# Altium schematic sheet MCU+IO.SchDoc: MCU
size A3; DrawnBy: Mogens Groth Nicolaisen; DocumentNumber: 3; SheetNumber: 3; SheetTotal: 7
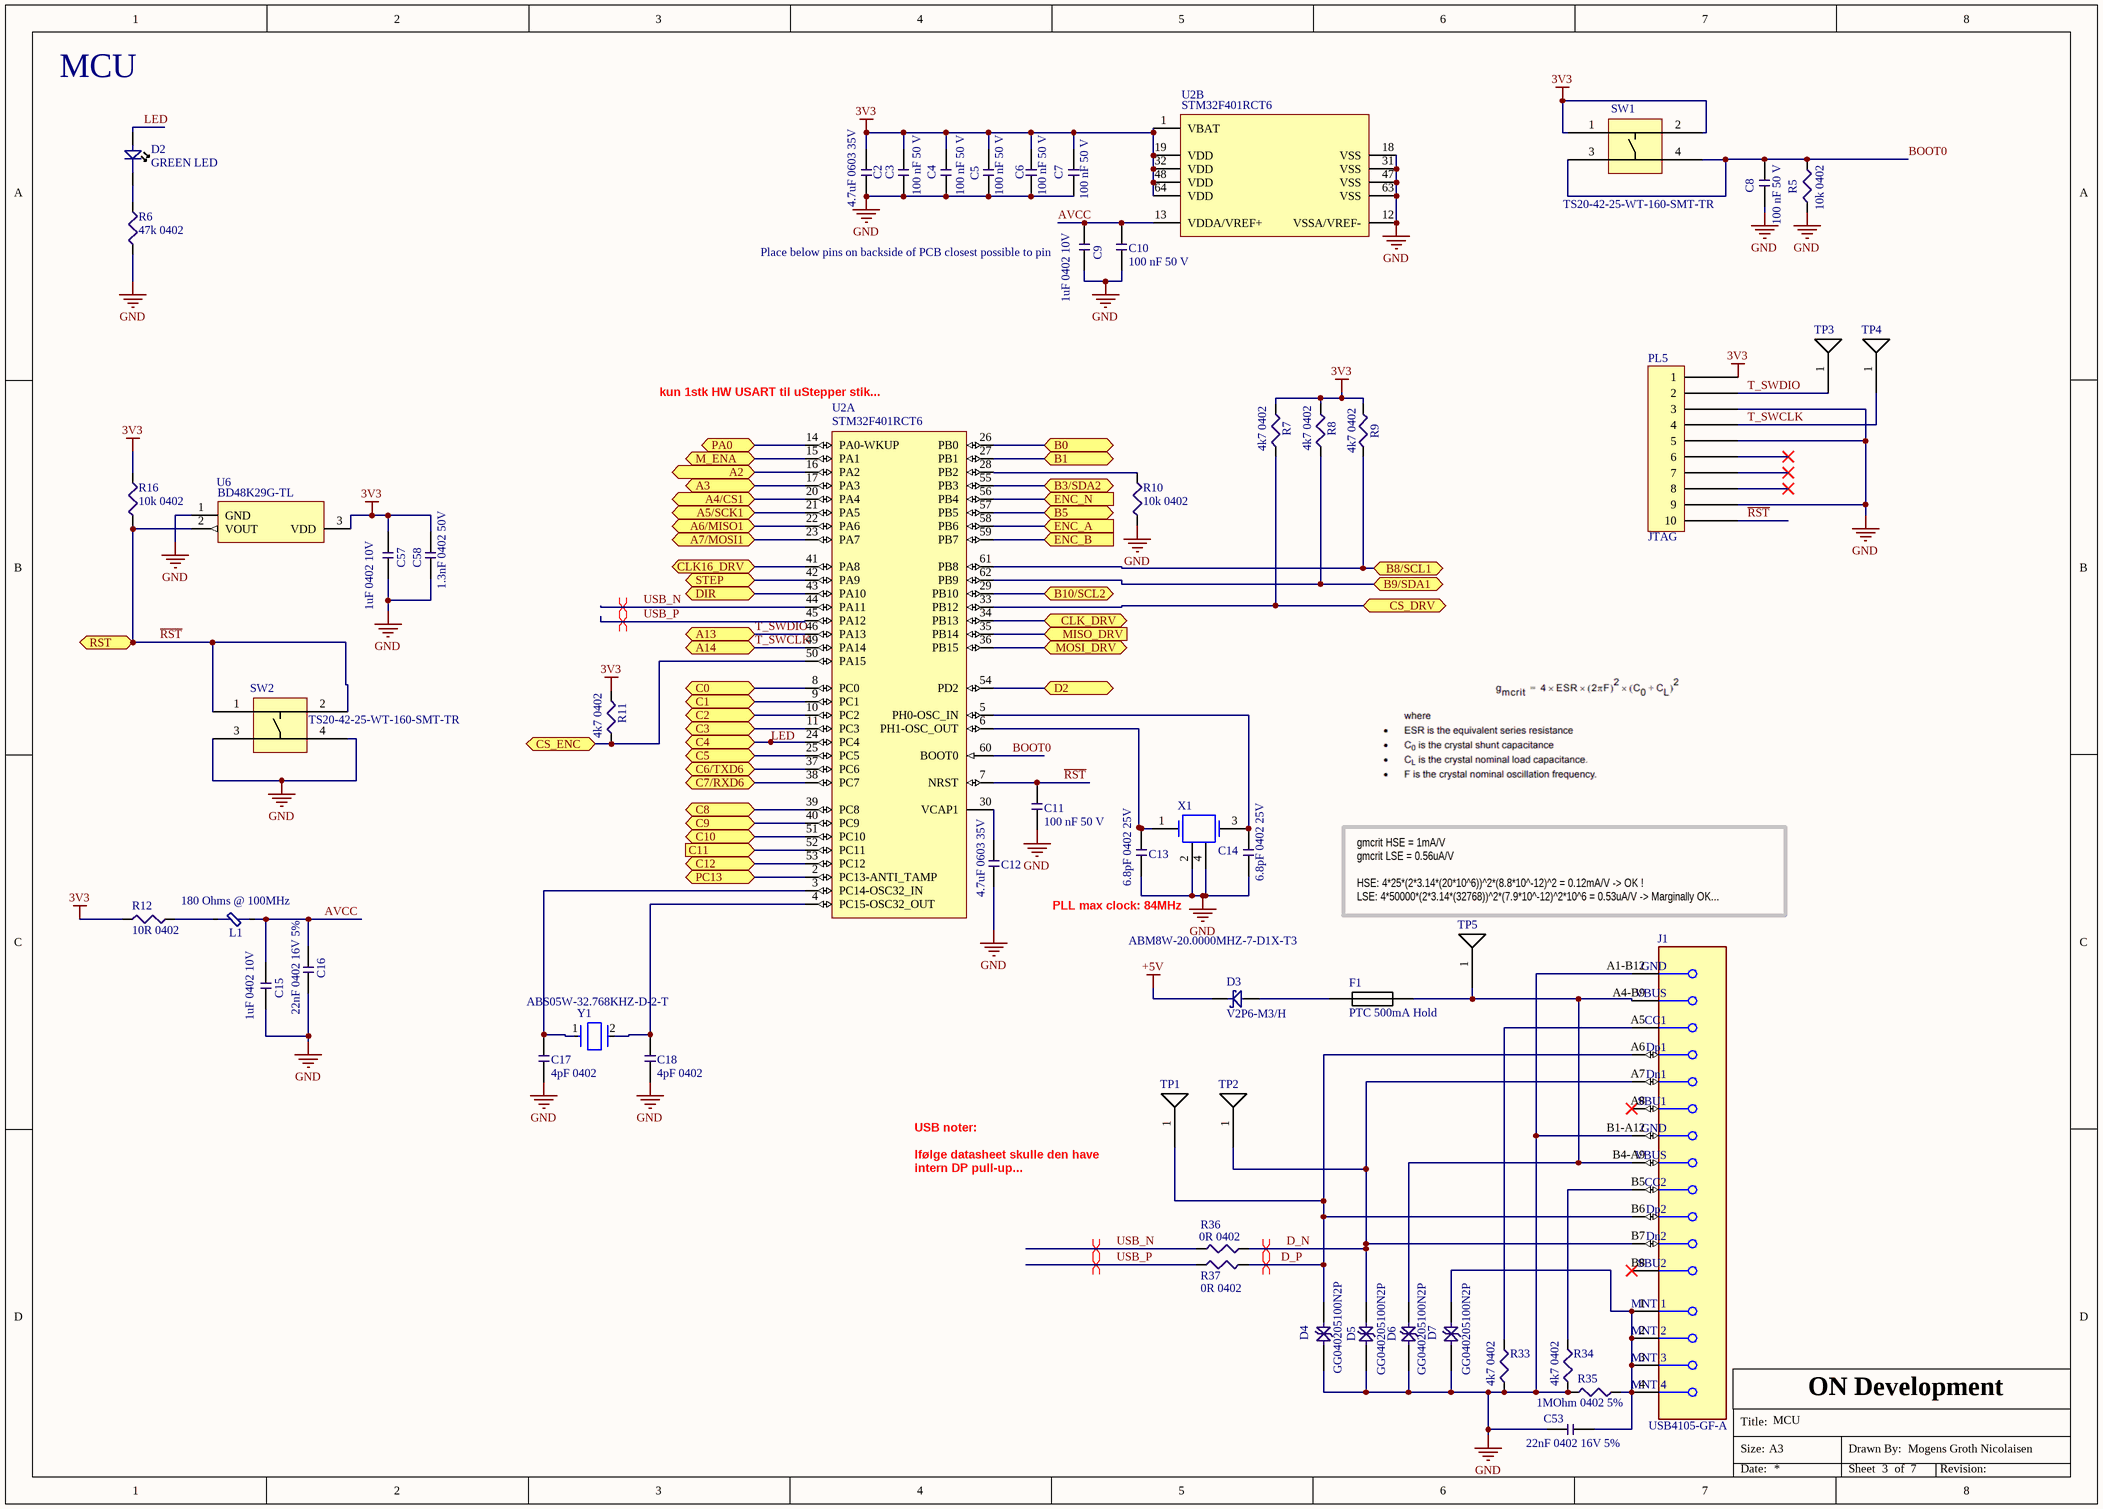
[diagram p0: MCU+IO.SchDoc]

## Parts
C2  4.7uF 0603 35V  [CAP_0603]
C3  100 nF 50 V  [CAP_0402]
C4  100 nF 50 V  [CAP_0402]
C5  100 nF 50 V  [CAP_0402]
C6  100 nF 50 V  [CAP_0402]
C7  100 nF 50 V  [CAP_0402]
C8  100 nF 50 V  [CAP_0402]
C9  1uF 0402 10V  [CAP_0402]
C10  100 nF 50 V  [CAP_0402]
C11  100 nF 50 V  [CAP_0402]
C12  4.7uF 0603 35V  [CAP_0603]
C13  6.8pF 0402 25V  [CAP_0402]
C14  6.8pF 0402 25V  [CAP_0402]
C15  1uF 0402 10V  [CAP_0402]
C16  22nF 0402 16V 5%  [CAP_0402]
C17  4pF 0402  [CAP_0402]
C18  4pF 0402  [CAP_0402]
C53  22nF 0402 16V 5%  [CAP_0402]
C57  1uF 0402 10V  [CAP_0402]
C58  1.3nF 0402 50V  [CAP_0402]
D2  GREEN LED  [0402 LED]
D3  V2P6-M3/H  [MicroSMP]
D4  Mfg. Part Number: GG040205100N2P  [RES_0402]  (hidden comment: TVS)
D5  Mfg. Part Number: GG040205100N2P  [RES_0402]  (hidden comment: TVS)
D6  Mfg. Part Number: GG040205100N2P  [RES_0402]  (hidden comment: TVS)
D7  Mfg. Part Number: GG040205100N2P  [RES_0402]  (hidden comment: TVS)
F1  PTC 500mA Hold  [PTC Fuse 1206]
J1  USB4105-GF-A  [FP-USB4105-GF-A-MFG]
L1  180 Ohms @ 100MHz  [IND_0603]
PL5  JTAG  [FP-62101021021-MFG]
R5  10k 0402  [RES_0402]
R6  47k 0402  [RES_0402]
R7  4k7 0402  [RES_0402]
R8  4k7 0402  [RES_0402]
R9  4k7 0402  [RES_0402]
R10  10k 0402  [RES_0402]
R11  4k7 0402  [RES_0402]
R12  10R 0402  [RES_0402]
R16  10k 0402  [RES_0402]
R33  4k7 0402  [RES_0402]
R34  4k7 0402  [RES_0402]
R35  1MOhm 0402 5%  [RES_0402]
R36  0R 0402  [RES_0402]
R37  0R 0402  [RES_0402]
SW1  TS20-42-25-WT-160-SMT-TR  [TS20-42-25-WT-160-SMT-TR-Footprint-1]
SW2  TS20-42-25-WT-160-SMT-TR  [TS20-42-25-WT-160-SMT-TR-Footprint-1]
TP1  TestPoint  [1x0mm]  (value not drawn)  (no BOM)
TP2  TestPoint  [1x0mm]  (value not drawn)  (no BOM)
TP3  TestPoint  [1x0mm]  (value not drawn)  (no BOM)
TP4  TestPoint  [1x0mm]  (value not drawn)  (no BOM)
TP5  TestPoint  [1x0mm]  (value not drawn)  (no BOM)
U2  STM32F401RCT6  [STM-LQFP64_M]  (parts A,B of 2)
U6  Manufacturer part no.:: BD48K29G-TL  [SOT95P282X125-3N]  (hidden comment: Supervisor)
X1  ABM8W-20.0000MHZ-7-D1X-T3  [3.2x2.5mm 4pin xtal]
Y1  ABS05W-32.768KHZ-D-2-T  [FP-ABS05W-MFG]

## Ports
A2 (bidir), A3 (bidir), A4/CS1 (bidir), A5/SCK1 (bidir), A6/MISO1 (bidir), A7/MOSI1 (bidir), A13 (bidir), A14 (bidir), B0 (bidir), B1 (bidir), B3/SDA2 (bidir), B5 (bidir), B8/SCL1 (bidir), B9/SDA1 (bidir), B10/SCL2 (bidir), C0 (bidir), C1 (bidir), C2 (bidir), C3 (bidir), C4 (bidir), C5 (bidir), C6/TXD6 (bidir), C7/RXD6 (bidir), C8 (bidir), C9 (bidir), C10 (bidir), C11 (in), C12 (bidir), CLK16_DRV (bidir), CLK_DRV (bidir), CS_DRV (bidir), CS_ENC (bidir), D2 (bidir), DIR (bidir), ENC_A (in), ENC_B (in), ENC_N (in), M_ENA (bidir), MISO_DRV (in), MOSI_DRV (bidir), PA0 (bidir), PC13 (bidir), RST (bidir), STEP (bidir)

## Nets
3V3: C2.2 C3.2 C4.2 C5.2 C6.2 C7.2 C57.2 C58.2 PL5.1 R7.2 R8.2 R9.2 R11.2 R12.1 R16.2 SW1.1 SW1.2 U2.1(VBAT) U2.19(VDD) U2.32(VDD) U2.48(VDD) U2.64(VDD) U6.3(VDD)
+5V: D3.2
GND: C2.1 C3.1 C4.1 C5.1 C6.1 C7.1 C8.1 C9.1 C10.1 C11.1 C12.1 C13.1 C14.1 C15.1 C16.1 C17.1 C18.1 C53.1 C57.1 C58.1 D4.1(Anode) D5.1(Anode) D6.1(Anode) D7.1(Anode) J1.A1-B12(GND) J1.B1-A12(GND) PL5.3 PL5.5 PL5.9 R5.1 R6.1 R10.1 R33.1 R34.1 R35.1 SW2.3 SW2.4 U2.12(VSSA/VREF-) U2.18(VSS) U2.31(VSS) U2.47(VSS) U2.63(VSS) U6.1(GND) X1.2(OSC2) X1.4(OSC2)
~{RST}: C11.2 PL5.10 R16.1 SW2.1 SW2.2 U2.7(NRST) U6.2(VOUT) ; port RST
A2: U2.16(PA2) ; port A2
A3: U2.17(PA3) ; port A3
A4/CS1: U2.20(PA4) ; port A4/CS1
A5/SCK1: U2.21(PA5) ; port A5/SCK1
A6/MISO1: U2.22(PA6) ; port A6/MISO1
A7/MOSI1: U2.23(PA7) ; port A7/MOSI1
AVCC: C9.2 C10.2 C15.2 C16.2 L1.2 U2.13(VDDA/VREF+)
B0: U2.26(PB0) ; port B0
B1: U2.27(PB1) ; port B1
B3/SDA2: U2.55(PB3) ; port B3/SDA2
B5: U2.57(PB5) ; port B5
B8/SCL1: R9.1 U2.61(PB8) ; port B8/SCL1
B9/SDA1: R8.1 U2.62(PB9) ; port B9/SDA1
B10/SCL2: U2.29(PB10) ; port B10/SCL2
BOOT0: C8.2 R5.2 SW1.3 SW1.4 U2.60(BOOT0)
C0: U2.8(PC0) ; port C0
C1: U2.9(PC1) ; port C1
C2: U2.10(PC2) ; port C2
C3: U2.11(PC3) ; port C3
C5: U2.25(PC5) ; port C5
C6/TXD6: U2.37(PC6) ; port C6/TXD6
C7/RXD6: U2.38(PC7) ; port C7/RXD6
C8: U2.39(PC8) ; port C8
C9: U2.40(PC9) ; port C9
C10: U2.51(PC10) ; port C10
C11: U2.52(PC11) ; port C11
C12: U2.53(PC12) ; port C12
CLK16_DRV: U2.41(PA8) ; port CLK16_DRV
CLK_DRV: U2.34(PB13) ; port CLK_DRV
CS_DRV: R7.1 U2.33(PB12) ; port CS_DRV
CS_ENC: R11.1 U2.50(PA15) ; port CS_ENC
D2: U2.54(PD2) ; port D2
D_N: D5.2(Cathode) J1.A7(Dn1) J1.B7(Dn2) R36.2 TP2.1
D_P: D4.2(Cathode) J1.A6(Dp1) J1.B6(Dp2) R37.2 TP1.1
DIR: U2.43(PA10) ; port DIR
ENC_A: U2.58(PB6) ; port ENC_A
ENC_B: U2.59(PB7) ; port ENC_B
ENC_N: U2.56(PB4) ; port ENC_N
LED: D2.1 U2.24(PC4) ; port C4
M_ENA: U2.15(PA1) ; port M_ENA
MISO_DRV: U2.35(PB14) ; port MISO_DRV
MOSI_DRV: U2.36(PB15) ; port MOSI_DRV
PA0: U2.14(PA0-WKUP) ; port PA0
PC13: U2.2(PC13-ANTI_TAMP) ; port PC13
STEP: U2.42(PA9) ; port STEP
T_SWCLK: PL5.4 TP4.1 U2.49(PA14) ; port A14
T_SWDIO: PL5.2 TP3.1 U2.46(PA13) ; port A13
USB_N: R36.1 U2.44(PA11)
USB_P: R37.1 U2.45(PA12)
NetC12_2: C12.2 U2.30(VCAP1)
NetC13_2: C13.2 U2.6(PH1-OSC_OUT) X1.1(OSC1)
NetC14_2: C14.2 U2.5(PH0-OSC_IN) X1.3(OSC2)
NetC17_2: C17.2 U2.3(PC14-OSC32_IN) Y1.1
NetC18_2: C18.2 U2.4(PC15-OSC32_OUT) Y1.2
NetC53_2: C53.2 D7.2(Cathode) J1.1(MNT_1) J1.2(MNT_2) J1.3(MNT_3) J1.4(MNT_4) R35.2
NetD2_2: D2.2 R6.2
NetD3_1: D3.1 F1.1
NetD6_2: D6.2(Cathode) F1.2 J1.A4-B9(VBUS) J1.B4-A9(VBUS) TP5.1
NetJ1_A5: J1.A5(CC1) R33.2
NetJ1_B5: J1.B5(CC2) R34.2
NetL1_1: L1.1 R12.2
NetR10_2: R10.2 U2.28(PB2)

Not connected (* = marked no-connect by the designer): J1 A8(SBU1)* B8(SBU2)*; PL5 6* 7* 8*

## Layout directives
differential pair: D_N, D_P, USB_N, USB_P

## Notes on the sheet
- Place below pins on backside of PCB closest possible to pin
- (near U2) kun 1stk HW USART til uStepper stik...
- PLL max clock: 84MHz
- (near TP5) gmcrit HSE = 1mA/V
  gmcrit LSE = 0.56uA/V
  HSE: 4*25*(2*3.14*(20*10^6))^2*(8.8*10^-12)^2 = 0.12mA/V -> OK !
  LSE: 4*50000*(2*3.14*(32768))^2*(7.9*10^-12)^2*10^6 = 0.53uA/V -> Marginally OK...
- (near TP1) USB noter:
  Ifølge datasheet skulle den have intern DP pull-up...
- ON Development
- Title:
- Size:
- A3
- Drawn By:
- Date:
- Sheet
- of
- Revision:

## Library data of the parts
C2 C12 = CMP-00134-0.1: CAPACITOR CERAMIC, 4.7UF, 35V, X5R, 10%, 0603; Capacitance: 4.7µF; Capacitance Tolerance: ± 10%; Dielectric...; Tolerance: 10%; Capacitance: 4.7uF; Case/Package: 0603; Case Code (Imperial): 0603; Case Code (Metric): 1608; Max Operating Temperature: 85°C; Min Operating Temperature: -55°C; Packaging: Tape and Reel; Series: C; Termination: SMD/SMT; Voltage Rating: 35V
C3-C8 C10 C11 = CMP-00088-2: Multilayer Ceramic Capacitors MLCC - SMD/SMT .1uF 50Volts X7R +/-10% 0402 STD; Tolerance: 10%; Value: 100nF; Voltage: 50 V; Voltage Rating: 50V; Mount: Surface Mount; Case/Package: 0402; Case Code (Imperial): 0402; Case Code (Metric): 1005; Min Operating Temperature: -55°C; Max Operating Temperature: 125°C; Capacitance: 100nF; Voltage Rating (DC): 50V; Packaging: Tape and Reel; Package Quantity: 10000; Dielectric: X7R; Termination: SMD/SMT; Length: 0.039inch; Height: 0.5mm; Width: 0.5mm; Thickness: 0.022inch; Lead Free: Lead Free; Halogen Free: Halogen Free
C9 C15 C57 = CMP-00032-5: 1uF 0402 10V 10% X5R; Material: Ceramic; Tolerance: 10%; Value: 1 uF; Voltage: 10 V; Capacitance: 1uF; Case/Package: 0402; Case Code (Imperial): 0402; Case Code (Metric): 1005; Contact Plating: Tin; Depth: 0.5mm; Dielectric: X5R; Height: 0.5mm; Length: 1mm; Max Operating Temperature: 85°C; Min Operating Temperature: -55°C; Mount: Surface Mount; Package Quantity: 1; Packaging: Tape and Reel; Radiation Hardening: No; Thickness: 0.022inch; Voltage Rating: 10V; Width: 0.02inch
C13 C14 = CMP-00154-2: Multilayer Ceramic Capacitors MLCC - SMD/SMT 0402 6.8pF 25volts C0G +/-0.25pF; Manufacturer Part No.: GRM1555C1E6R8CA01D; Value: 6.8pF; Voltage: 25V
C16 C53 = CMP-00176-1: 22nF 0402 16V X7R 5%; Mfg. Part Number: GRM155R71C223JA01D; Tolerance: 5%; Value: 22nF; Voltage: 16V
C17 C18 = CMP-00172-2: GJM1555C1HR40BB01D ; Rohs; Murata ; Cap Ceramic 0.4PF 50V C0G 0402; Tolerance: 0.1pF; Value: 4pF; Voltage: 50V; Manufacturer Part No: GJM1555C1HR40BB01D
C58 = CMP-00174-1: Cap Ceramic 0.0013uF 50V C0G 5% SMD 0402 125°C Paper T/R; Manufacturer Part no.: C0402C132J5GAC7867; Tolerance: 10%; Value: 1.3nF; Voltage: 50V
D2 = CMP-008-0001-2: 0402 SMD LED; Mfg. Part Number: LTST-C281KGKT
D3 = CMP-016-0002-2: DIODE SCHOTTKY 60V 2A MICROSMP
D4-D7 = CMP-016-0004-2: TVS DIODE 12VC 8A IPP 0402
F1 = CMP-017-0001-1: PTC RESET FUSE 8V 500MA 1206; Mfg. Part Number: 0ZCJ0050FF2G; Case/Package: 1206; Mount: SMD; Pins: 2; RoHS: Yes
J1 = CMP-003-0034-0.0: Conn USB 2.0 Type C RCP 24 POS 0.3mm/0.5mm Solder RA SMD 24 Terminal 1 Port T/R; Gender: Receptacle; Mating Cycles: 10000; Number of Ports: 1; Shielding: Shielded; Connector Type: USB; Contact Plating: Gold; Flammability Rating: UL94 V-0; Insulation Color: Black; Max Operating Temperature: 85°C; Min Operating Temperature: -40°C; Mount: Surface Mount,Through Hole,Horizontal; Series: USB4105; Termination: Solder
L1 = CMP-ROOT-0005-2: FERRITE BEAD 180 OHM 0603 1LN; Mfg. Part Number: BLM18PG181SN1D; Current: 1.5A; Value: 180 Ohm; Case/Package: 0603
PL5 = CMP-003-0036-0.2: Conn, Header, 10Pos, 2Row, 1.27Mm Rohs Compliant: Yes; Gender: Male; RoHS Compliant: Yes; Contact Material: Copper Alloy
R5 R10 R16 = CMP-001-0019-3: RES SMD 10K OHM 1% 1/16W 0402; Mfg. Part Number: RMCF0402FT10K0; Case/Package: 0402; Power: 1/16 W; Tolerance: 1 %; Value: 10k
R6 = CMP-001-0027-3: RES SMD 47K OHM 1% 1/16W 0402; Mfg. Part Number: RMCF0402FT47K0; Case/Package: 0402; Power: 1/16W; Tolerance: 1%; Value: 47k
R7-R9 R11 R33 R34 = CMP-001-0029-3: RES SMD 4.7K OHM 1% 1/16W 0402; Mfg. Part Number: RC1005F472CS; Tolerance: 1; Case/Package: 0402; Power: 1/16W; Value: 4k7
R12 = CMP-001-0033-3: RES SMD 10 OHM 1% 1/16W 0402; Mfg. Part Number: 0402WGF100JTCE; Power: 63mW; Case/Package: 0402; Tolerance: 1%; Value: 10R
R35 = CMP-001-0065-1: RES SMD 1M OHM 5% 1/16W 0402; Mfg. Part Number: CR0402JC1MS001; Value: 1Mega; Case/Package: 0402; Power: 1/16 W; Tolerance: 5%
R36 R37 = CMP-001-0055-1: RES SMD 0 OHM 1/16W 0402; Mfg. Part Number: RC0402JR-070RL; Power: 63mW; Case/Package: 0402; Tolerance: -; Value: 0R
SW1 SW2 = CMP-013-0004-2: Tactile Switch SPST-NO Top Actuated Surface Mount; Case/Package: -; Mount: SMD; Pins: 4; RoHS: Yes; Mfg. Part No.: TS20-42-25-WT-160-SMT-TR
TP1-TP5 = CMP-ROOT-0006-0.0
U2 = CMP-ROOT-00011-1: ARM® Cortex®-M4 STM32 F4 Microcontroller IC 32-Bit 84MHz 256KB (256K x 8) FLASH; Case/Package: LQFP; Mount: SMD; RoHS: Yes; Manufacturer Part No.: STM32F401RCT6; PartId: 1
U6 = CMP-00178-1: IC DETECTOR VOLT 2.9V OD SSOP3; Case/Package: SOT23-3; Mount: SMD; Pins: 3; RoHS: Yes
X1 = CMP-ROOT-00010-2: Crystal 20MHz ±10ppm (Tol) ±20ppm (Stability) 7pF FUND 50Ohm 4-Pin SMD T/R; Case/Package: SMD/SMT; Mount: Surface Mount; RoHS: Yes; Manufacturer Part No.: ABM8W-20.0000MHZ-7-D1X-T3
Y1 = CMP-ROOT-00014-1: ABS05W IoT Optimized Crystal 32.768KHz 4pF 70K Ohm ±20ppm 2-Pin SMD T/R; Case/Package: SMD/SMT; Mount: Surface Mount; RoHS: Yes; Manufacturer Part No.: ABS05W-32.768KHZ-D-2-T